# Altium schematic sheet SUPPER_SEAL.SchDoc
size A
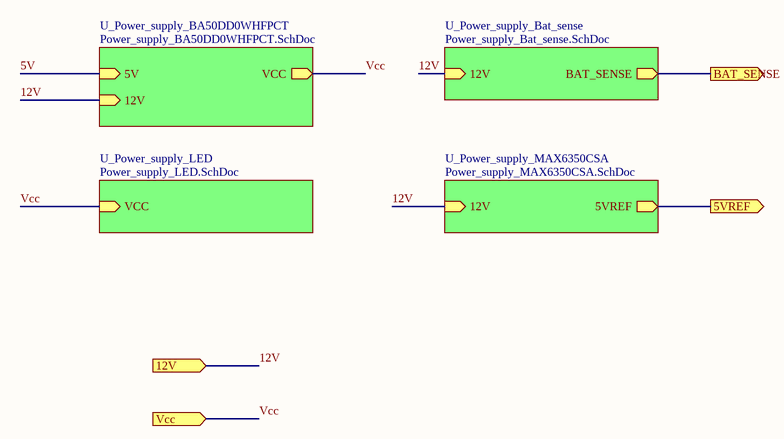
[diagram p0: SUPPER_SEAL.SchDoc]

## Sub-sheets
U_Power_supply_BA50DD0WHFPCT = Power_supply_BA50DD0WHFPCT.SchDoc: 5V (in), 12V (in), VCC (out)
U_Power_supply_Bat_sense = Power_supply_Bat_sense.SchDoc: 12V (in), BAT_SENSE (out)
U_Power_supply_LED = Power_supply_LED.SchDoc: VCC (in)
U_Power_supply_MAX6350CSA = Power_supply_MAX6350CSA.SchDoc: 12V (in), 5VREF (out)

## Ports
5VREF (out), 12V (in), BAT_SENSE (out), Vcc (in)

## Nets
5V: sheet U_Power_supply_BA50DD0WHFPCT/5V
5VREF: port 5VREF, sheet U_Power_supply_MAX6350CSA/5VREF
12V: port 12V, sheet U_Power_supply_BA50DD0WHFPCT/12V, sheet U_Power_supply_Bat_sense/12V, sheet U_Power_supply_MAX6350CSA/12V
BAT_SENSE: port BAT_SENSE, sheet U_Power_supply_Bat_sense/BAT_SENSE
Vcc: port Vcc, sheet U_Power_supply_BA50DD0WHFPCT/VCC, sheet U_Power_supply_LED/VCC